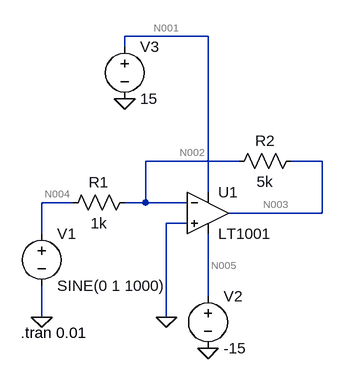
[diagram p0: schematic Draft1.asc]
Draft1.asc, the LTspice schematic file:
Version 4
SHEET 1 880 680
WIRE 144 -160 16 -160
WIRE 16 -144 16 -160
WIRE 192 32 48 32
WIRE 320 32 272 32
WIRE 144 80 144 -160
WIRE -64 96 -112 96
WIRE 48 96 48 32
WIRE 48 96 16 96
WIRE 112 96 48 96
WIRE 320 112 320 32
WIRE 320 112 176 112
WIRE 112 128 80 128
WIRE -112 144 -112 96
WIRE 144 240 144 144
WIRE -112 272 -112 224
WIRE 80 272 80 128
FLAG -112 272 0
FLAG 80 272 0
FLAG 16 -64 0
FLAG 144 320 0
SYMBOL OpAmps\\LT1001 144 48 R0
SYMATTR InstName U1
SYMBOL res 288 16 R90
WINDOW 0 0 56 VBottom 2
WINDOW 3 32 56 VTop 2
SYMATTR InstName R2
SYMATTR Value 5k
SYMBOL res 32 80 R90
WINDOW 0 0 56 VBottom 2
WINDOW 3 32 56 VTop 2
SYMATTR InstName R1
SYMATTR Value 1k
SYMBOL voltage -112 128 R0
WINDOW 123 0 0 Left 0
WINDOW 39 0 0 Left 0
SYMATTR InstName V1
SYMATTR Value SINE(0 1 1000)
SYMBOL voltage 144 224 R0
WINDOW 123 0 0 Left 0
WINDOW 39 0 0 Left 0
SYMATTR InstName V2
SYMATTR Value -15
SYMBOL voltage 16 -160 R0
WINDOW 123 0 0 Left 0
WINDOW 39 0 0 Left 0
SYMATTR InstName V3
SYMATTR Value 15
TEXT -144 296 Left 2 !.tran 0.01

The netlist it stands for:
* Draft1.asc
XU1 0 N002 N001 N005 N003 LT1001  ; pins In+ In- V+ V- OUT
R2 N003 N002 5k
R1 N002 N004 1k
V1 N004 0 SINE(0 1 1000)
V2 N005 0 -15
V3 N001 0 15
.tran 0.01
.lib LTC.lib
.backanno
.end

* Results of the author's LTspice run, read from the files saved beside the schematic
* Operating Point, zero values left out:
*   V(n001) = 15 V
*   V(n005) = -15 V
*   I(V3) = -2.25 mA
*   I(V2) = 2.25 mA
*   Ix(u1:3) = 2.25 mA
*   Ix(u1:4) = -2.25 mA
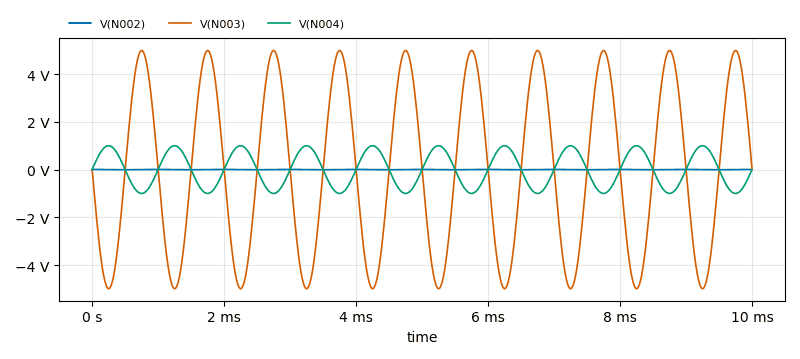
[diagram p1: Transient Analysis of Draft1.asc, plotted from the saved traces]
* Transient Analysis, 1 run:
*   V(N002): min -5.931 mV, max 5.934 mV, average -579.9 nV, rms 4.187 mV, last 5.934 mV
*   V(N003): min -4.995 V, max 4.995 V, average 0 V, rms 3.532 V, last 35.61 mV
*   V(N004): min -1 V, max 1 V, average -855.9 nV, rms 707.2 mV, last 0 V